# Altium schematic sheet HeatSink.SchDoc
size A4
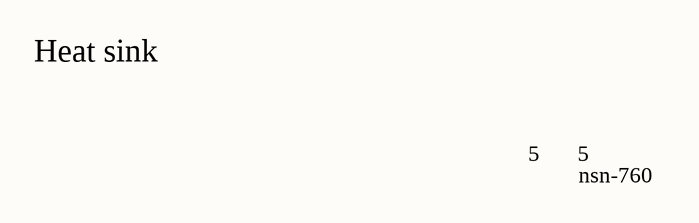
[diagram p0: HeatSink.SchDoc]

## Notes on the sheet
- Heat sink
- 5
- nsn-760